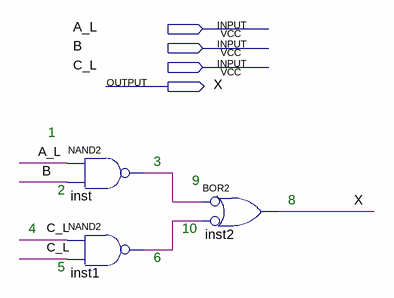
[diagram p0: schematic sheet]
// Quartus schematic Quiz1.bdf as structural Verilog: 3 symbols, 4 pins
module Quiz1 (
  input  A_L,
  input  B,
  input  C_L,
  output X
);

  wire inst1_out, inst_out;

  nand inst (inst_out, A_L, B);
  nand inst1 (inst1_out, C_L, C_L);
  or inst2 (X, ~inst_out, ~inst1_out);  // BOR2

  // Notes on the sheet:
  //   1
  //   3
  //   9
  //   2
  //   8
  //   4
  //   10
  //   6
  //   5
endmodule
